# Altium schematic sheet SD_TF-CARD.SchDoc
size 297 x 209 mm; SheetNumber: 15; SheetTotal: 32
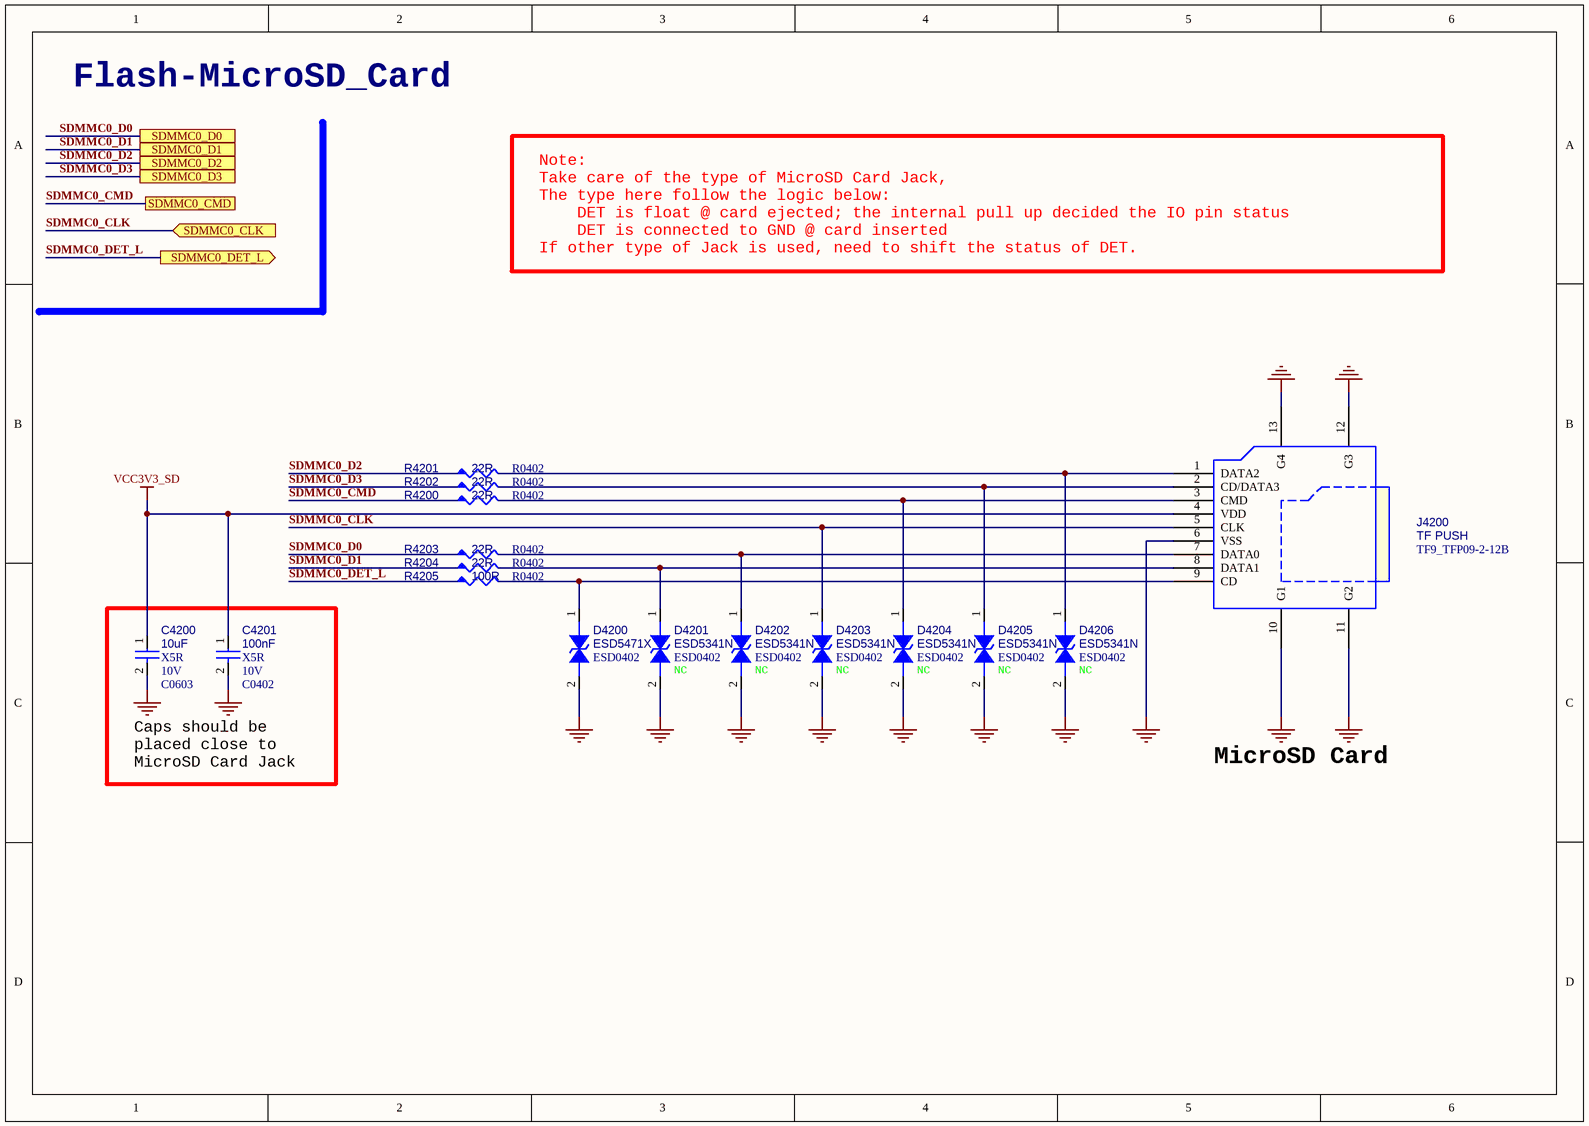
[diagram p0: SD_TF-CARD.SchDoc]

## Parts
C4200  10uF  Dielectric: X5R  Voltage: 10V  [C0603]
C4201  100nF  Dielectric: X5R  Voltage: 10V  [C0402]
D4200  ESD5471X  [ESD0402]
D4201  ESD5341N  option: NC  [ESD0402]
D4202  ESD5341N  option: NC  [ESD0402]
D4203  ESD5341N  option: NC  [ESD0402]
D4204  ESD5341N  option: NC  [ESD0402]
D4205  ESD5341N  option: NC  [ESD0402]
D4206  ESD5341N  option: NC  [ESD0402]
J4200  TF PUSH  PCB Footprint: TF9_TFP09-2-12B  [TF-SMD_TF-PUSH]
R4200  22R  [R0402]
R4201  22R  [R0402]
R4202  22R  [R0402]
R4203  22R  [R0402]
R4204  22R  [R0402]
R4205  100R  [R0402]

## Ports
SDMMC0_CLK (in, see CONTROLLER-RK3562[3B], RK3562-VCCIO2-VCCIO3[4C]), SDMMC0_CMD (see CONTROLLER-RK3562[3B], RK3562-VCCIO2-VCCIO3[4C]), SDMMC0_D0 (see CONTROLLER-RK3562[3B], RK3562-VCCIO2-VCCIO3[4C]), SDMMC0_D1 (see CONTROLLER-RK3562[3B], RK3562-VCCIO2-VCCIO3[4C]), SDMMC0_D2 (see CONTROLLER-RK3562[3B], RK3562-VCCIO2-VCCIO3[4C]), SDMMC0_D3 (see CONTROLLER-RK3562[3B], RK3562-VCCIO2-VCCIO3[4C]), SDMMC0_DET_L (out, see CONTROLLER-RK3562[3B], RK3562-PMUIO-OSC-PLL[5B])

## Nets
GND: C4200.2 C4201.2 D4200.2 D4201.2 D4202.2 D4203.2 D4204.2 D4205.2 D4206.2 J4200.6(VSS) J4200.10(G1) J4200.11(G2) J4200.12(G3) J4200.13(G4)
VCC3V3_SD: C4200.1 C4201.1 J4200.4(VDD)
SDMMC0_CLK: D4203.1 J4200.5(CLK) ; port SDMMC0_CLK
SDMMC0_CMD: R4200.1 ; port SDMMC0_CMD
SDMMC0_D0: R4203.1 ; port SDMMC0_D0
SDMMC0_D1: R4204.1 ; port SDMMC0_D1
SDMMC0_D2: R4201.1 ; port SDMMC0_D2
SDMMC0_D3: R4202.1 ; port SDMMC0_D3
SDMMC0_DET_L: R4205.1 ; port SDMMC0_DET_L
NetD4200_1: D4200.1 J4200.9(CD) R4205.2
NetD4201_1: D4201.1 J4200.8(DATA1) R4204.2
NetD4202_1: D4202.1 J4200.7(DATA0) R4203.2
NetD4204_1: D4204.1 J4200.3(CMD) R4200.2
NetD4205_1: D4205.1 J4200.2(CD/DATA3) R4202.2
NetD4206_1: D4206.1 J4200.1(DATA2) R4201.2

## Notes on the sheet
- Flash-MicroSD_Card
- Note:
  Take care of the type of MicroSD Card Jack,
  The type here follow the logic below:
  DET is float @ card ejected; the internal pull up decided the IO pin status
  DET is connected to GND @ card inserted
  If other type of Jack is used, need to shift the status of DET.
- Caps should be
  placed close to
  MicroSD Card Jack
- MicroSD Card

## Library data of the parts
C4200 = CAP NP: cap,10.00uF,+/-10%,10V,X5R,C0603; Part Reference: C4200; Manufacturer PN: C1608X5R1A106K080AC; Manufacturer: TDK; Tolerance: 10%; C_Voltage: 6.3V; Priority: A; PCB Footprint: C0603; Value: 10uF; Created by: JJJ; Part Type: C0603; RK PN: C1608X5R1A106K080AC
C4201 = CAP NP: cap,100.00nF,+/-10%,10V,X5R,C0402; Part Reference: C4201; Manufacturer: TDK; RK PN: C1005X5R1A104K050BA; Priority: A; Tolerance: 10%; C_Voltage: 6.3V; PCB Footprint: C0402; Value: 100nF; Part Type: C0402; Manufacturer PN: C1005X5R1A104K050BA; Created by: JJJ
D4200 = DIODE BI_DIR TRIG: 1-Line, Bi-directional, Transient Voltage Suppressors.9pF.; Part Reference: D4200; Manufacturer: WillSemi(韦尔半导体); Priority: A; PCB Footprint: ESD0402; Value: ESD5471X; Created by: JJJ; Manufacturer PN: ESD5471X; Part Type: ESD_TVS; RK PN: ESD5471X
D4201 = DIODE BI_DIR TRIG: 1-Line, Bi-directional, Transient Voltage Suppressors.1pF.; Part Reference: D4201; Manufacturer: WillSemi(韦尔半导体); Priority: A; PCB Footprint: ESD0402; Value: ESD5341N; RK PN: ESD5341N; Part Type: ESD_TVS; Manufacturer PN: ESD5341N; Created by: JJJ
D4202 = DIODE BI_DIR TRIG: 1-Line, Bi-directional, Transient Voltage Suppressors.1pF.; Part Reference: D4202; Manufacturer: WillSemi(韦尔半导体); Priority: A; PCB Footprint: ESD0402; Value: ESD5341N; RK PN: ESD5341N; Part Type: ESD_TVS; Manufacturer PN: ESD5341N; Created by: JJJ
D4203 = DIODE BI_DIR TRIG: 1-Line, Bi-directional, Transient Voltage Suppressors.1pF.; Part Reference: D4203; Manufacturer: WillSemi(韦尔半导体); Priority: A; PCB Footprint: ESD0402; Value: ESD5341N; Created by: JJJ; Manufacturer PN: ESD5341N; Part Type: ESD_TVS; RK PN: ESD5341N
D4204 = DIODE BI_DIR TRIG: 1-Line, Bi-directional, Transient Voltage Suppressors.1pF.; Part Reference: D4204; Manufacturer: WillSemi(韦尔半导体); Priority: A; PCB Footprint: ESD0402; Value: ESD5341N; Created by: JJJ; Manufacturer PN: ESD5341N; Part Type: ESD_TVS; RK PN: ESD5341N
D4205 = DIODE BI_DIR TRIG: 1-Line, Bi-directional, Transient Voltage Suppressors.1pF.; Part Reference: D4205; Manufacturer: WillSemi(韦尔半导体); Priority: A; PCB Footprint: ESD0402; Value: ESD5341N; Created by: JJJ; Manufacturer PN: ESD5341N; Part Type: ESD_TVS; RK PN: ESD5341N
D4206 = DIODE BI_DIR TRIG: 1-Line, Bi-directional, Transient Voltage Suppressors.1pF.; Part Reference: D4206; Manufacturer: WillSemi(韦尔半导体); Priority: A; PCB Footprint: ESD0402; Value: ESD5341N; Created by: JJJ; Manufacturer PN: ESD5341N; Part Type: ESD_TVS; RK PN: ESD5341N
J4200 = TFCARD_SOCKET: 通用TF卡座，全尺寸; Part Reference: J4200; Manufacturer: 旺科达; Value: TFP09-2-12B; Priority: A; RK PN: TFP09-2-12B; Part Type: CARD Jack; Manufacturer Part Number: TFP09-2-12B; Created by: JJJ
R4200 = RESISTOR5: 通用厚膜电阻,22R,+/-5%,R0402,1/16W.; Part Reference: R4200; Manufacturer: YAGEO; Manufacturer PN: RC0402JR-0722RL; Tolerance: 5%; RK PN: 901001505; Priority: A; Wattage: 1/16W; PCB Footprint: R0402; Value: 22R; Part Type: 通用厚膜电阻; Created by: YTL
R4201 = RESISTOR5: 通用厚膜电阻,22R,+/-5%,R0402,1/16W.; Part Reference: R4201; Manufacturer: YAGEO; Manufacturer PN: RC0402JR-0722RL; Tolerance: 5%; RK PN: 901001505; Priority: A; Wattage: 1/16W; PCB Footprint: R0402; Value: 22R; Part Type: 通用厚膜电阻; Created by: YTL
R4202 = RESISTOR5: 通用厚膜电阻,22R,+/-5%,R0402,1/16W.; Part Reference: R4202; Manufacturer: YAGEO; Manufacturer PN: RC0402JR-0722RL; Tolerance: 5%; RK PN: 901001505; Priority: A; Wattage: 1/16W; PCB Footprint: R0402; Value: 22R; Part Type: 通用厚膜电阻; Created by: YTL
R4203 = RESISTOR5: 通用厚膜电阻,22R,+/-5%,R0402,1/16W.; Part Reference: R4203; Manufacturer: YAGEO; Manufacturer PN: RC0402JR-0722RL; Tolerance: 5%; RK PN: 901001505; Priority: A; Wattage: 1/16W; PCB Footprint: R0402; Value: 22R; Part Type: 通用厚膜电阻; Created by: YTL
R4204 = RESISTOR5: 通用厚膜电阻,22R,+/-5%,R0402,1/16W.; Part Reference: R4204; Manufacturer: YAGEO; Manufacturer PN: RC0402JR-0722RL; Tolerance: 5%; RK PN: 901001505; Priority: A; Wattage: 1/16W; PCB Footprint: R0402; Value: 22R; Part Type: 通用厚膜电阻; Created by: YTL
R4205 = RESISTOR5: 通用厚膜电阻,100R,+/-5%,R0402,1/16W.; Part Reference: R4205; Manufacturer PN: RC0402JR-07100RL; Manufacturer: YAGEO; Tolerance: 5%; Wattage: 1/16W; Priority: A; RK PN: 901001448; PCB Footprint: R0402; Value: 100R; Created by: YTL; Part Type: 通用厚膜电阻